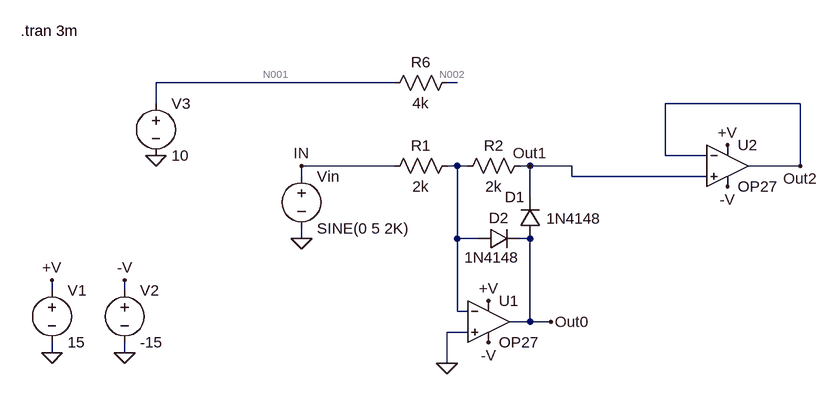
[diagram p0: schematic OP27-rectifier-buffer.asc]
OP27-rectifier-buffer.asc, the LTspice schematic file:
Version 4
SHEET 1 1728 700
WIRE 432 -1472 64 -1472
WIRE 528 -1472 512 -1472
WIRE 64 -1440 64 -1472
WIRE 1056 -1440 848 -1440
WIRE 848 -1360 848 -1440
WIRE 912 -1360 848 -1360
WIRE 432 -1344 288 -1344
WIRE 528 -1344 512 -1344
WIRE 544 -1344 528 -1344
WIRE 640 -1344 624 -1344
WIRE 704 -1344 640 -1344
WIRE 1056 -1344 1056 -1440
WIRE 1056 -1344 976 -1344
WIRE 288 -1328 288 -1344
WIRE 704 -1328 704 -1344
WIRE 912 -1328 704 -1328
WIRE 640 -1296 640 -1344
WIRE 288 -1232 288 -1248
WIRE 528 -1232 528 -1344
WIRE 560 -1232 528 -1232
WIRE 640 -1232 624 -1232
WIRE -96 -1152 -96 -1168
WIRE 16 -1152 16 -1168
WIRE 528 -1120 528 -1232
WIRE 544 -1120 528 -1120
WIRE 640 -1104 640 -1232
WIRE 640 -1104 608 -1104
WIRE 672 -1104 640 -1104
WIRE 544 -1088 512 -1088
WIRE -96 -1056 -96 -1072
WIRE 16 -1056 16 -1072
WIRE 512 -1040 512 -1088
FLAG -96 -1168 +V
FLAG 288 -1232 0
FLAG 288 -1344 IN
FLAG 576 -1136 +V
FLAG 16 -1168 -V
FLAG 576 -1072 -V
FLAG 16 -1056 0
FLAG -96 -1056 0
FLAG 512 -1040 0
FLAG 944 -1376 +V
FLAG 944 -1312 -V
FLAG 640 -1344 Out1
FLAG 1056 -1344 Out2
FLAG 672 -1104 Out0
FLAG 64 -1360 0
SYMBOL voltage -96 -1168 R0
WINDOW 123 0 0 Left 2
WINDOW 39 0 0 Left 2
SYMATTR InstName V1
SYMATTR Value 15
SYMBOL voltage 288 -1344 R0
WINDOW 123 24 146 Left 2
WINDOW 39 24 125 Left 2
SYMATTR InstName Vin
SYMATTR Value SINE(0 5 2K)
SYMBOL res 528 -1360 R90
WINDOW 0 0 56 VBottom 2
WINDOW 3 32 56 VTop 2
SYMATTR InstName R1
SYMATTR Value 2k
SYMBOL res 640 -1360 R90
WINDOW 0 0 56 VBottom 2
WINDOW 3 32 56 VTop 2
SYMATTR InstName R2
SYMATTR Value 2k
SYMBOL voltage 16 -1168 R0
WINDOW 123 24 146 Left 2
WINDOW 39 24 125 Left 2
SYMATTR InstName V2
SYMATTR Value -15
SYMBOL opamps\\OP27 576 -1168 R0
SYMATTR InstName U1
SYMBOL diode 656 -1232 R180
WINDOW 0 24 64 Left 2
WINDOW 3 -94 31 Left 2
SYMATTR InstName D1
SYMATTR Value 1N4148
SYMBOL diode 560 -1216 R270
WINDOW 0 32 32 VTop 2
WINDOW 3 3 21 VBottom 2
SYMATTR InstName D2
SYMATTR Value 1N4148
SYMBOL opamps\\OP27 944 -1408 R0
SYMATTR InstName U2
SYMBOL voltage 64 -1456 R0
WINDOW 123 0 0 Left 2
WINDOW 39 0 0 Left 2
SYMATTR InstName V3
SYMATTR Value 10
SYMBOL res 528 -1488 R90
WINDOW 0 0 56 VBottom 2
WINDOW 3 32 56 VTop 2
SYMATTR InstName R6
SYMATTR Value 4k
TEXT -144 -1552 Left 2 !.tran 3m

The netlist it stands for:
* OP27-rectifier-buffer.asc
V1 +V 0 15
Vin IN 0 SINE(0 5 2K)
R1 N003 IN 2k
R2 Out1 N003 2k
V2 -V 0 -15
XU1 0 N003 +V -V Out0 OP27  ; pins In+ In- V+ V- OUT
D1 Out0 Out1 1N4148
D2 N003 Out0 1N4148
XU2 Out1 Out2 +V -V Out2 OP27  ; pins In+ In- V+ V- OUT
V3 N001 0 10
R6 N002 N001 4k
.model D D
.lib standard.dio
.tran 3m
.lib ADI.lib
.backanno
.end

* Results of the author's LTspice run, read from the files saved beside the schematic
* Operating Point, zero values left out:
*   V(+v) = 15 V
*   V(-v) = -15 V
*   V(n001) = 10 V
*   V(n002) = 10 V
*   I(V1) = -5.935 mA
*   I(V2) = 5.935 mA
*   Ix(u1:3) = 2.968 mA
*   Ix(u1:4) = -2.968 mA
*   Ix(u2:3) = 2.968 mA
*   Ix(u2:4) = -2.968 mA
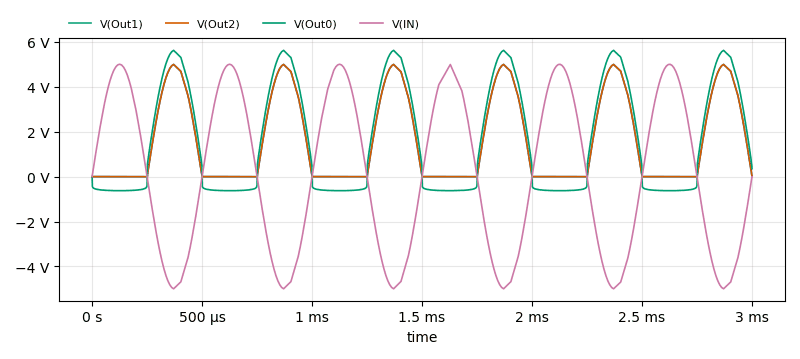
[diagram p1: Transient Analysis of OP27-rectifier-buffer.asc, plotted from the saved traces]
* Transient Analysis, 1 run:
*   V(Out1): min -16.67 mV, max 4.991 V, average 1.581 V, rms 2.487 V, last 12.01 mV
*   V(Out2): min -16.88 mV, max 4.991 V, average 1.581 V, rms 2.487 V, last 12.2 mV
*   V(Out0): min -627.2 mV, max 5.618 V, average 1.581 V, rms 2.911 V, last 353.6 mV
*   V(IN): min -4.993 V, max 5 V, average 941 µV, rms 3.52 V, last 0 V